# Altium project HandlebarTouchFPCB.PrjPCB
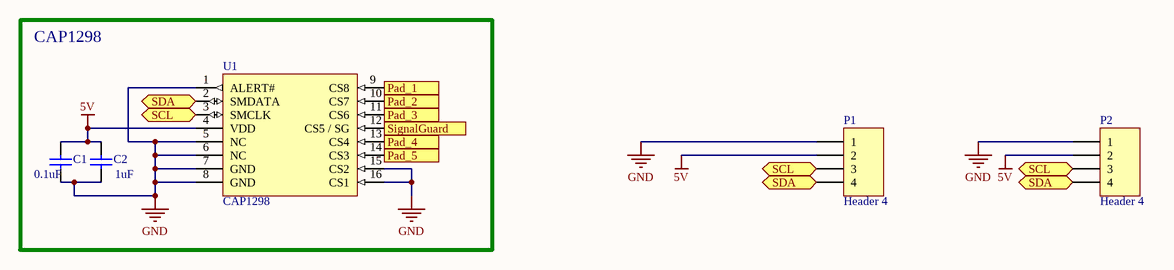
[diagram p0: HandlebarTouchFPCB_v1.1.SchDoc]
1 sheet, 5 parts. Net scope: flat (ports and power ports of the same name join across sheets).
Board files: HandlebarToucFPCB.PcbDoc, HandlebarToucFPCB_v1.1.PcbDoc, HandlebarTouchFPCB_RIGHT_v1.2.PcbDoc, HandlebarTouchFPCB_LEFT_v1.2.PcbDoc, HandlebarTouch_RIGID-FLEX_RIGHT_v1.3.PcbDoc

## Sheet HandlebarTouchFPCB_v1.1.SchDoc
size A4

### Parts
C1  value 0.1uF  [CAP 0805 b]  (hidden comment: Cap)
C2  value 1uF  [CAP 0805 b]  (hidden comment: Cap)
P1  Header 4  [FPCB_4_Connector]
P2  Header 4  [4PAD_CONNECTOR_SHORT]
U1  CAP1298  [QFN-COL 16 (3x3)  V2]

### Blocks framed on the sheet
CAP1298: C1 C2 U1

### Ports
Pad_1 (in), Pad_2 (in), Pad_3 (in), Pad_4 (in), Pad_5 (in), SCL (bidir), SDA (bidir), SignalGuard (out)

### Nets
5V: C1.2 C2.2 P1.2 P2.2 U1.4(VDD)
GND: C1.1 C2.1 P1.1 P2.1 U1.1(ALERT#) U1.5(NC) U1.6(NC) U1.7(GND) U1.8(GND) U1.15(CS2) U1.16(CS1)
Pad_1: U1.9(CS8) ; port Pad_1
Pad_2: U1.10(CS7) ; port Pad_2
Pad_3: U1.11(CS6) ; port Pad_3
Pad_4: U1.13(CS4) ; port Pad_4
Pad_5: U1.14(CS3) ; port Pad_5
SCL: P1.3 P2.3 U1.3(SMCLK) ; port SCL
SDA: P1.4 P2.4 U1.2(SMDATA) ; port SDA
SignalGuard: U1.12(CS5_/_SG) ; port SignalGuard

### Library data of the parts
C1 = Cap Semi: YAGEO (PHYCOMP)  CC0805KRX7R8BB104  COND, CERÁ MULT, X7R, 100NF, 25V, 0805; Published: 8-Jun-2000; LatestRevisionDate: 29-May-2009; LatestRevisionNote: IPC-7351 Footprint Added.; PackageReference: C1206; Publisher: Altium Limited; PackageDescription: Chip Capacitor; Supplier 1: Farnell; Supplier Part Number 1: 644249
C2 = Cap Semi: TAIYO YUDEN  TMK212BJ105KG-T  COND, CERÁ MULT, X5R, 1UF, 25V, 0805; Published: 8-Jun-2000; LatestRevisionDate: 29-May-2009; LatestRevisionNote: IPC-7351 Footprint Added.; PackageReference: C1206; Publisher: Altium Limited; PackageDescription: Chip Capacitor; Supplier 1: Farnell; Supplier Part Number 1: 2112855
P1 P2 = Header 4: Header, 4-Pin; LatestRevisionDate: 17-Jul-2002; LatestRevisionNote: Re-released for DXP Platform.; Publisher: Altium Limited
U1 = CAP1298: Supplier 1: Farnell; Supplier Part Number 1: 2373292